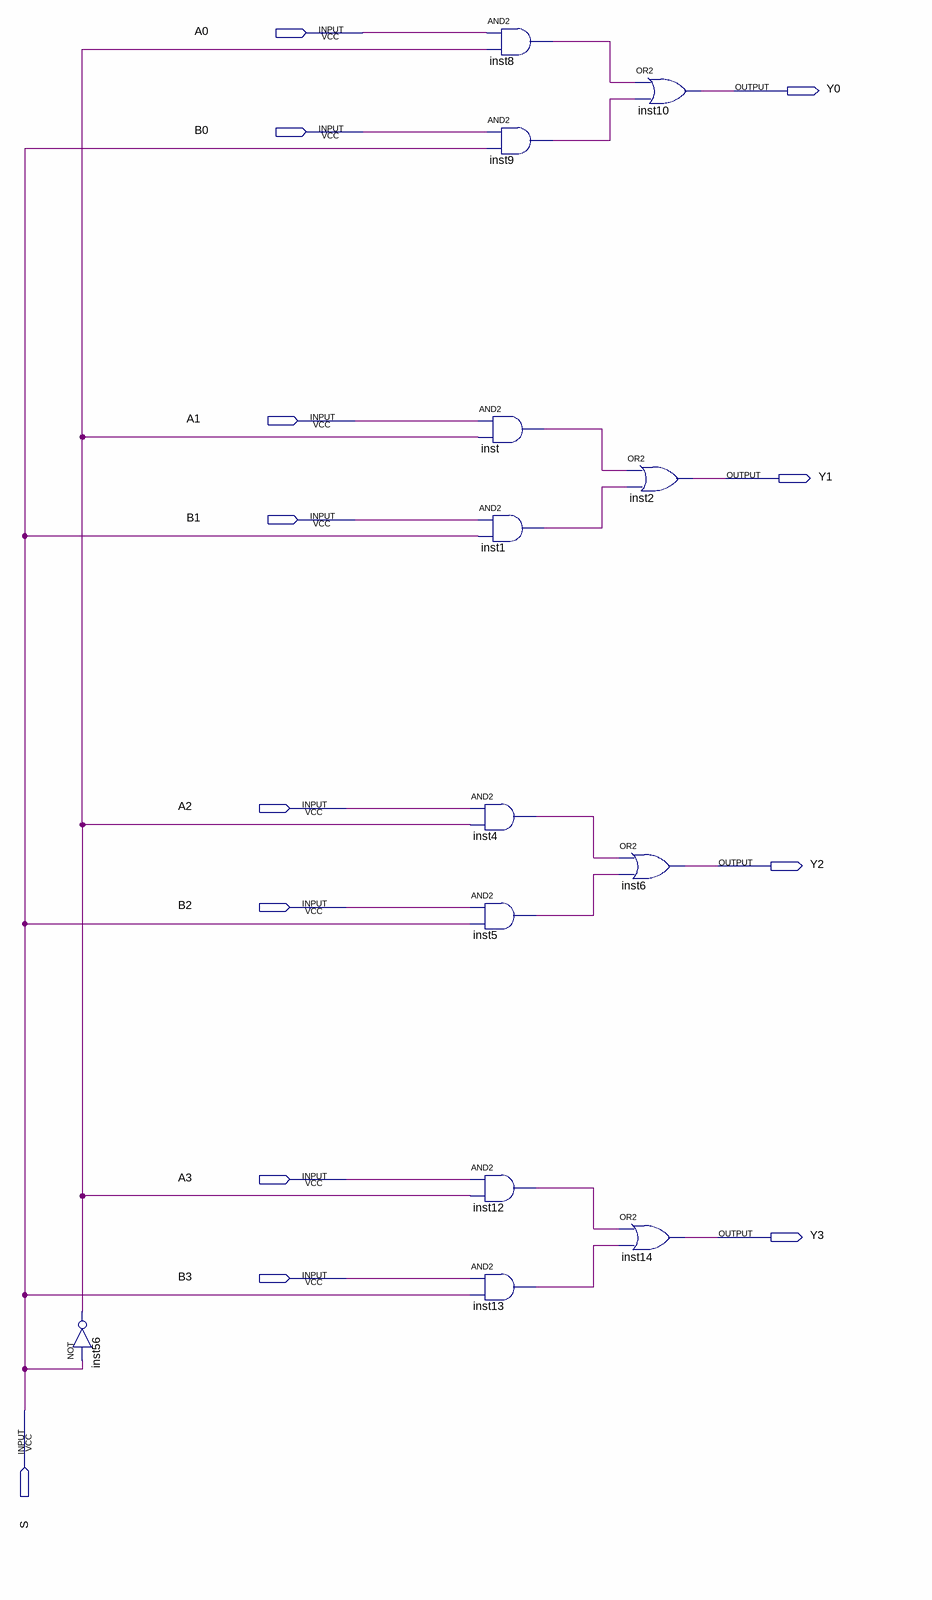
[diagram p0: schematic sheet]
// Quartus schematic MuxCuadruple.bdf as structural Verilog: 13 symbols, 13 pins
module MuxCuadruple (
  input  A0,
  input  B0,
  input  A1,
  input  B1,
  input  A2,
  input  B2,
  input  A3,
  input  B3,
  input  S,
  output Y0,
  output Y1,
  output Y2,
  output Y3
);

  wire inst1_out, inst4_out, inst5_out, inst8_out, inst9_out, inst12_out, inst13_out, inst56_out, inst_out;

  not inst56 (inst56_out, S);
  and inst8 (inst8_out, A0, inst56_out);
  and inst9 (inst9_out, B0, S);
  and inst (inst_out, A1, inst56_out);
  and inst1 (inst1_out, B1, S);
  and inst4 (inst4_out, A2, inst56_out);
  and inst5 (inst5_out, B2, S);
  and inst12 (inst12_out, A3, inst56_out);
  and inst13 (inst13_out, B3, S);
  or inst10 (Y0, inst8_out, inst9_out);
  or inst2 (Y1, inst_out, inst1_out);
  or inst6 (Y2, inst4_out, inst5_out);
  or inst14 (Y3, inst12_out, inst13_out);
endmodule
